# EAGLE design Schematic (EAGLE 9.6.2)
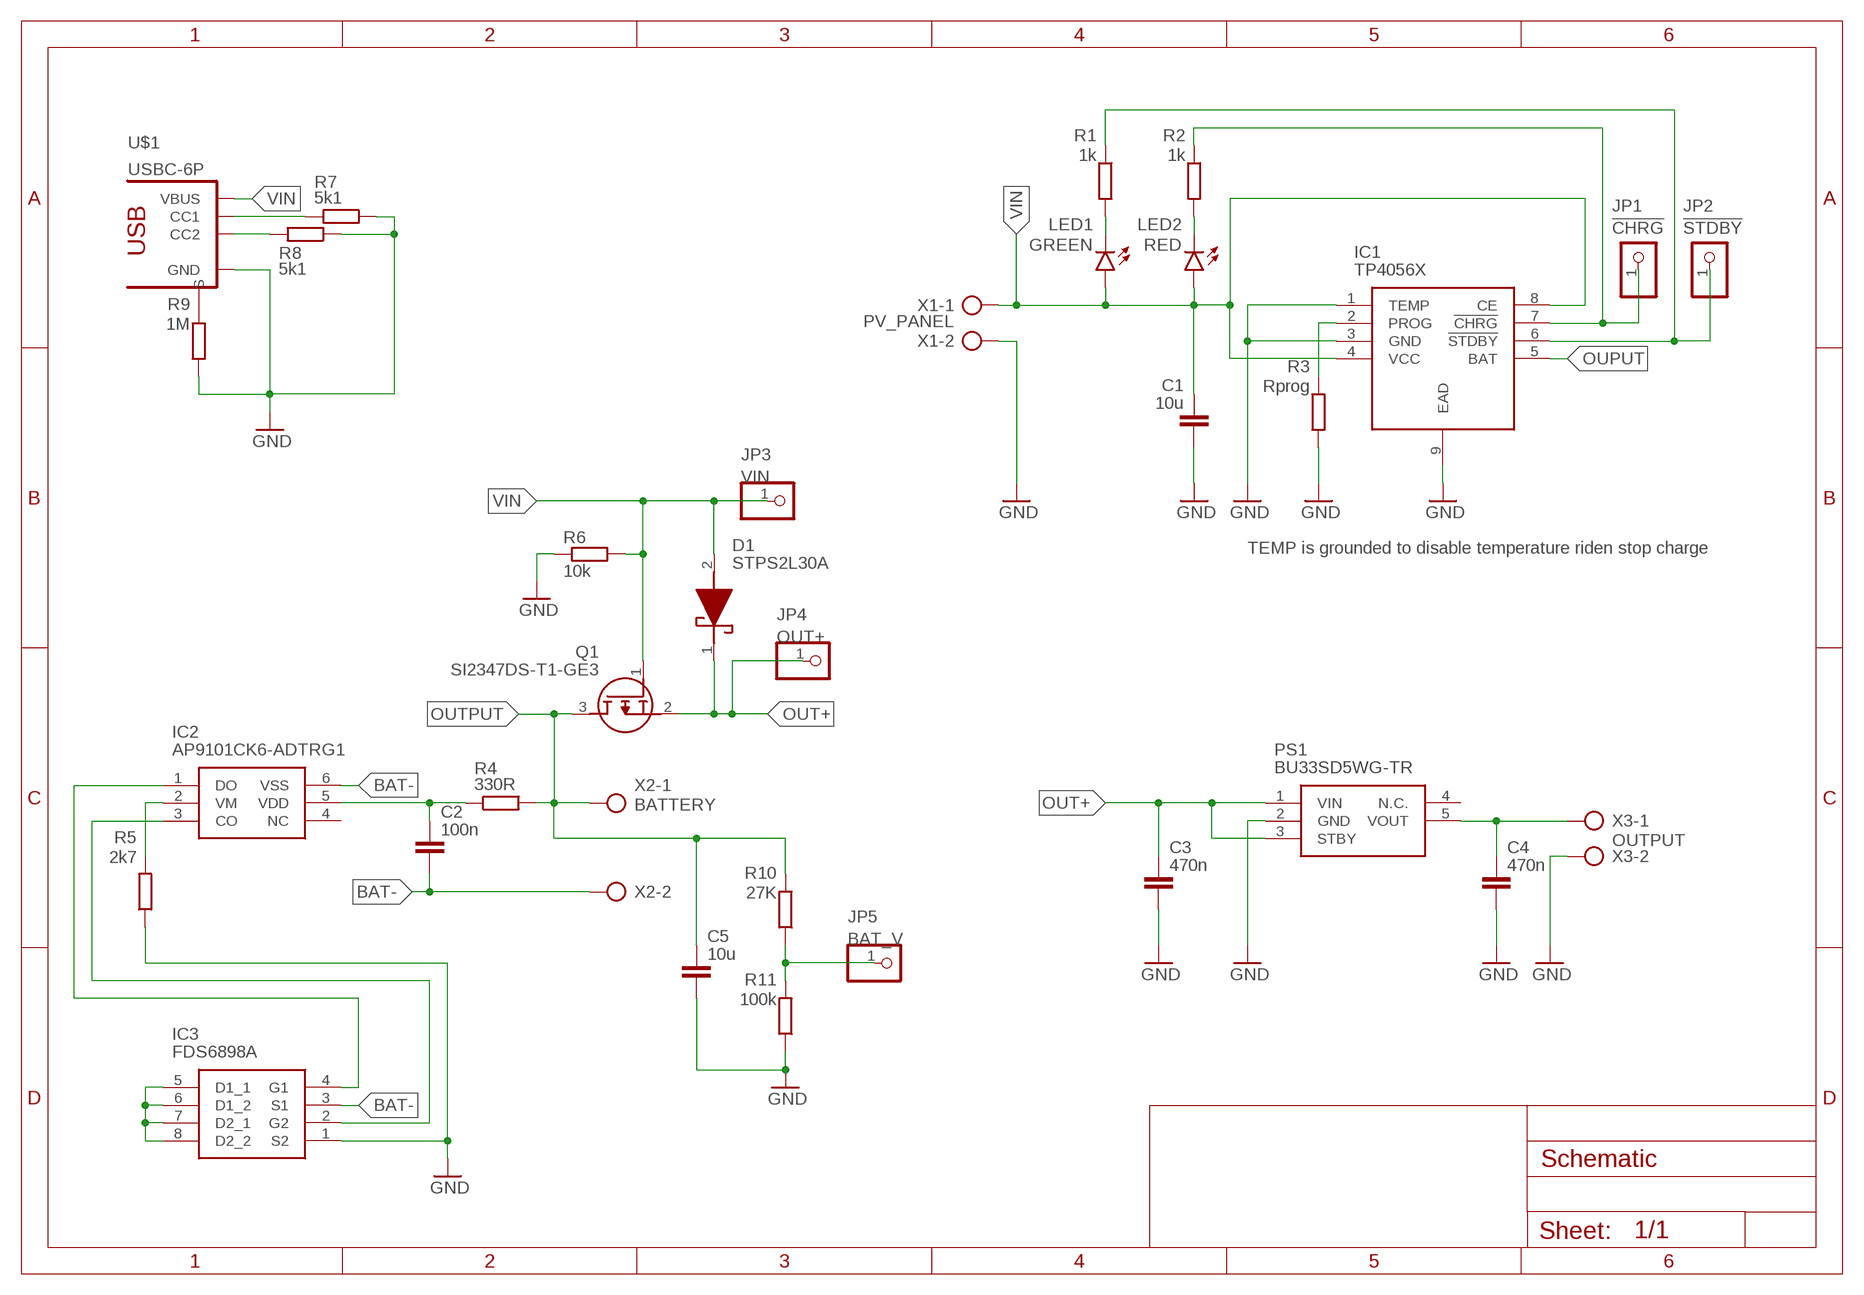
[diagram p0: schematic, sheet 1]

## Parts
C1  10u  C-EUC0805  [C0805]
C2  100n  C-EUC0805  [C0805]
C3  470n  C-EUC0805  [C0805]
C4  470n  C-EUC0805  [C0805]
C5  10u  C-EUC0805  [C0805]
D1  STPS2L30A  [DIOM5126X265N]
IC1  TP4056X  [SOIC127P600X175-9N]
IC2  AP9101CK6-ADTRG1  [SOT95P285X140-6N]
IC3  FDS6898A  [SOIC127P600X175-8N]
JP1  !CHRG  PINHD-1X1  [1X01]
JP2  !STDBY  PINHD-1X1  [1X01]
JP3  VIN  PINHD-1X1  [1X01]
JP4  OUT+  PINHD-1X1  [1X01]
JP5  BAT_V  PINHD-1X1  [1X01]
LED1  GREEN  LEDCHIPLED_0805  [CHIPLED_0805]
LED2  RED  LEDCHIPLED_0805  [CHIPLED_0805]
PS1  BU33SD5WG-TR  [SOT95P280X125-5N]
Q1  SI2347DS-T1-GE3  [SOT95P237X112-3N]
R1  1k  R-EU_R0805  [R0805]
R2  1k  R-EU_R0805  [R0805]
R3  Rprog  R-EU_R0805  [R0805]
R4  330R  R-EU_R0805  [R0805]
R5  2k7  R-EU_R0805  [R0805]
R6  10k  R-EU_R0805  [R0805]
R7  5k1  R-EU_R0805  [R0805]
R8  5k1  R-EU_R0805  [R0805]
R9  1M  R-EU_R0805  [R0805]
R10  27K  R-EU_R0805  [R0805]
R11  100k  R-EU_R0805  [R0805]
U$1  USBC-6P  [USCX-06FX-XXMX-01]
X1  PV_PANEL  AK300/2  [AK300/2]
X2  BATTERY  AK300/2  [AK300/2]
X3  OUTPUT  AK300/2  [AK300/2]

## Nets
BAT-: C2.2 IC2.6(VSS) IC3.3(S1) X2.2
GND: C1.2 C3.2 C4.2 C5.2 IC1.1(TEMP) IC1.3(GND) IC1.9(EAD) IC3.1(S2) PS1.2(GND) R3.2 R5.1 R6.1 R7.1 R8.1 R9.2 R11.1 U$1.GND1(GND) U$1.GND2(GND) X1.2 X3.2
N$1: LED1.C R1.2
N$2: LED2.C R2.2
N$3: IC1.6(!STDBY) JP2.1 R1.1
N$4: IC1.2(PROG) R3.1
N$5: C2.1 IC2.5(VDD) R4.1
N$6: IC1.7(!CHRG) JP1.1 R2.1
N$7: R9.1 U$1.SHIELD1(S) U$1.SHIELD2(S) U$1.SHIELD3(S) U$1.SHIELD4(S)
N$8: R8.2 U$1.CC2
N$9: IC2.2(VM) R5.2
N$10: IC2.1(DO) IC3.4(G1)
N$11: R7.2 U$1.CC1
N$12: IC2.3(CO) IC3.2(G2)
N$13: IC3.5(D1_1) IC3.6(D1_2) IC3.7(D2_1) IC3.8(D2_2)
N$14: C4.1 PS1.5(VOUT) X3.1
N$15: JP5.1 R10.1 R11.2
OUPUT: IC1.5(BAT)
OUT+: C3.1 D1.1(K) JP4.1 PS1.1(VIN) PS1.3(STBY) Q1.2(S)
OUTPUT: C5.1 Q1.3(D) R4.2 R10.2 X2.1
VIN: C1.1 D1.2(A) IC1.4(VCC) IC1.8(CE) JP3.1 LED1.A LED2.A Q1.1(G) R6.2 U$1.VBUS1(VBUS) U$1.VBUS2(VBUS) X1.1
Unconnected: IC2.4(NC) PS1.4(N.C.)

## Notes on the sheet
- TEMP is grounded to disable temperature riden stop charge

## Library data of the parts
C1-C5 = rcl:C-EU: CAPACITOR, European symbol; SPICEPREFIX: C
D1 = 1-component-search:STPS2L30A: STPS2L30A, Schottky Diode, 2A max, 30V, 2-Pin, SMA Source: Datasheet <http://www.st.com/web/en/resource/technical/document/datasheet/CD00001633.pdf>; ARROW_PART_NUMBER: STPS2L30A; ARROW_PRICE-STOCK: https://www.arrow.com/en/products/stps2l30a/stmicroelectronics?region=nac; DESCRIPTION: STPS2L30A, Schottky Diode, 2A max, 30V, 2-Pin, SMA; HEIGHT: 2.65mm; MANUFACTURER_NAME: STMicroelectronics; MANUFACTURER_PART_NUMBER: STPS2L30A; MOUSER_PART_NUMBER: 511-STPS2L30A; MOUSER_PRICE-STOCK: https://www.mouser.co.uk/ProductDetail/STMicroelectronics/STPS2L30A?qs=yAkVQ3mwCG0OEYUK4%252B3dww%3D%3D
IC1 = TP4056X:TP4056X: PMIC - Battery Management SOP-8_EP_150mil RoHS Source: Datasheet <https://datasheet.lcsc.com/szlcsc/Nanjing-Extension-Microelectronics-TP4056X_C191323.pdf>; DESCRIPTION: PMIC - Battery Management SOP-8_EP_150mil RoHS; HEIGHT: 1.75mm; MANUFACTURER_NAME: Nanjing Extension Microelectronics; MANUFACTURER_PART_NUMBER: TP4056X
IC2 = 1-component-search:AP9101CK6-ADTRG1: Battery Management Protect w/ Pwr Down 1-Cell LI 3.0uA 3.5V Source: Datasheet <https://www.diodes.com/assets/Datasheets/AP9101C.pdf>; ARROW_PART_NUMBER: AP9101CK6-ADTRG1; ARROW_PRICE-STOCK: https://www.arrow.com/en/products/ap9101ck6-adtrg1/diodes-incorporated?region=nac; DESCRIPTION: Battery Management Protect w/ Pwr Down 1-Cell LI 3.0uA 3.5V; HEIGHT: 1.4mm; MANUFACTURER_NAME: Diodes Inc.; MANUFACTURER_PART_NUMBER: AP9101CK6-ADTRG1; MOUSER_PART_NUMBER: 621-AP9101CK6-ADTRG1; MOUSER_PRICE-STOCK: https://www.mouser.co.uk/ProductDetail/Diodes-Incorporated/AP9101CK6-ADTRG1?qs=W66WzN12R3ZRpT78WZD49g%3D%3D
IC3 = 1-component-search:FDS6898A: ON SEMICONDUCTOR - FDS6898A. - MOSFET, DUAL, N, SMD, SO-8 Source: Datasheet <https://www.onsemi.com/pub/Collateral/FDS6898A-D.PDF>; ARROW_PART_NUMBER: FDS6898A; ARROW_PRICE-STOCK: https://www.arrow.com/en/products/fds6898a/on-semiconductor?region=nac; DESCRIPTION: ON SEMICONDUCTOR - FDS6898A. - MOSFET, DUAL, N, SMD, SO-8; HEIGHT: 1.75mm; MANUFACTURER_NAME: onsemi; MANUFACTURER_PART_NUMBER: FDS6898A; MOUSER_PART_NUMBER: 512-FDS6898A; MOUSER_PRICE-STOCK: https://www.mouser.co.uk/ProductDetail/ON-Semiconductor-Fairchild/FDS6898A?qs=rFoKx6q3%2F911Dc6GES2NNA%3D%3D
JP1 JP2 JP4 JP5 = pinhead:PINHD-1X1: PIN HEADER
JP3 = pinhead:PINHD-1X1: PIN HEADER; SPICEPREFIX: X
LED1 LED2 = led:LED: LED OSRAM: - CHIPLED LG R971, LG N971, LY N971, LG Q971, LY Q971, LO R971, LY R971 LH N974, LH R974 LS Q976, LO Q976, LY Q976 LO Q996 - Hyper CHIPLED LW Q18S LB Q993, LB Q99A, LB R99A - SideLED LS A670, LO A670, LY A670, LG A670, LP A670 LB A673, LV A673, LT A673, LW A673 LH A674 LY A675 LS A676, LA A676, LO A676, LY A676, LW A676 LS A679, LY A679, LG A679 - Hyper Micro SIDELED® LS Y876, LA Y876, LO Y876, LY Y876 LT Y87S - SmartLED LW L88C, LW L88S LB L89C, LB L89S, LG L890 LS L89K, LO L89K, LY L89K LS L896, LA L896, LO L896, LY L896 - TOPLED LS T670, LO T670, LY T670, LG T670, LP T670 LSG T670, LSP T670, LSY T670, LOP T670, LYG T670 LG T671, LOG T671, LSG T671 LB T673, LV T673, LT T673, LW T673 LH T674 LS T676, LA T676, LO T676, LY T676, LB T676, LH T676, LSB T676, LW T676 LB T67C, LV T67C, LT T67C, LS T67K, LO T67K, LY T67K, LW E67C LS E67B, LA E67B, LO E67B, LY E67B, LB E67C, LV E67C, LT E67C LW T67C LS T679, LY T679, LG T679 LS T770, LO T770, LY T770, LG T770, LP T770 LB T773, LV T773, LT T773, LW T773 LH T774 LS E675, LA E675, LY E675, LS T675 LS T776, LA T776, LO T776, LY T776, LB T776 LHGB T686 LT T68C, LB T68C - Hyper Mini TOPLED® LB M676 - Mini TOPLED Santana® LG M470 LS M47K, LO M47K, LY M47K Source: http://www.osram.convergy.de LUXEON: - LUMILED® LXK2-PW12-R00, LXK2-PW12-S00, LXK2-PW14-U00, LXK2-PW14-V00 LXK2-PM12-R00, LXK2-PM12-S00, LXK2-PM14-U00 LXK2-PE12-Q00, LXK2-PE12-R00, LXK2-PE12-S00, LXK2-PE14-T00, LXK2-PE14-U00 LXK2-PB12-K00, LXK2-PB12-L00, LXK2-PB12-M00, LXK2-PB14-N00, LXK2-PB14-P00, LXK2-PB14-Q00 LXK2-PR12-L00, LXK2-PR12-M00, LXK2-PR14-Q00, LXK2-PR14-R00 LXK2-PD12-Q00, LXK2-PD12-R00, LXK2-PD12-S00 LXK2-PH12-R00, LXK2-PH12-S00 LXK2-PL12-P00, LXK2-PL12-Q00, LXK2-PL12-R00 Source: www.luxeon.com KINGBRIGHT: KA-3528ASYC Source: www.kingbright.com
PS1 = 1-component-search:BU33SD5WG-TR: LDO regulator,3.3V,0.5A,standby,SSOP5 ROHM BU33SD5WG-TR, LDO Voltage Regulator, 0.5A, 3.3 V +/-2%, 1.7 6 Vin, 5-Pin SSOP Source: Datasheet <https://componentsearchengine.com/Datasheets/1/BU33SD5WG-TR.pdf>; DESCRIPTION: LDO regulator,3.3V,0.5A,standby,SSOP5 ROHM BU33SD5WG-TR, LDO Voltage Regulator, 0.5A, 3.3 V +/-2%, 1.7 6 Vin, 5-Pin SSOP; HEIGHT: 1.25mm; MANUFACTURER_NAME: ROHM Semiconductor; MANUFACTURER_PART_NUMBER: BU33SD5WG-TR; MOUSER_PART_NUMBER: 755-BU33SD5WG-TR; MOUSER_PRICE-STOCK: https://www.mouser.co.uk/ProductDetail/ROHM-Semiconductor/BU33SD5WG-TR?qs=%2FKR40Cd6GUrQDzRkUEt69Q%3D%3D
Q1 = 1-component-search:SI2347DS-T1-GE3: P-Ch MOSFET SOT-23 copper 30V 42mohm @ 1 Source: Datasheet <https://www.vishay.com/docs/62827/si2347ds.pdf>; ARROW_PART_NUMBER: SI2347DS-T1-GE3; ARROW_PRICE-STOCK: https://www.arrow.com/en/products/si2347ds-t1-ge3/vishay?region=nac; DESCRIPTION: P-Ch MOSFET SOT-23 copper 30V 42mohm @ 1; HEIGHT: 1.12mm; MANUFACTURER_NAME: Vishay; MANUFACTURER_PART_NUMBER: Si2347DS-T1-GE3; MOUSER_PART_NUMBER: 78-SI2347DS-T1-GE3; MOUSER_PRICE-STOCK: https://www.mouser.co.uk/ProductDetail/Vishay-Semiconductors/SI2347DS-T1-GE3?qs=wnm%2FPMJNddFQv4lfacOrcA%3D%3D
R1-R11 = rcl:R-EU_: RESISTOR, European symbol; SPICEPREFIX: R
U$1 = USBC6P:USBC-6P: AliExpress Special! Connect 5.1k 10% resistors to each CC pin, pulled up to 3.3v or 5.0v.
X1-X3 = con-ptr500:AK300/2: CONNECTOR; OC_FARNELL: unknown; OC_NEWARK: unknown

## Board
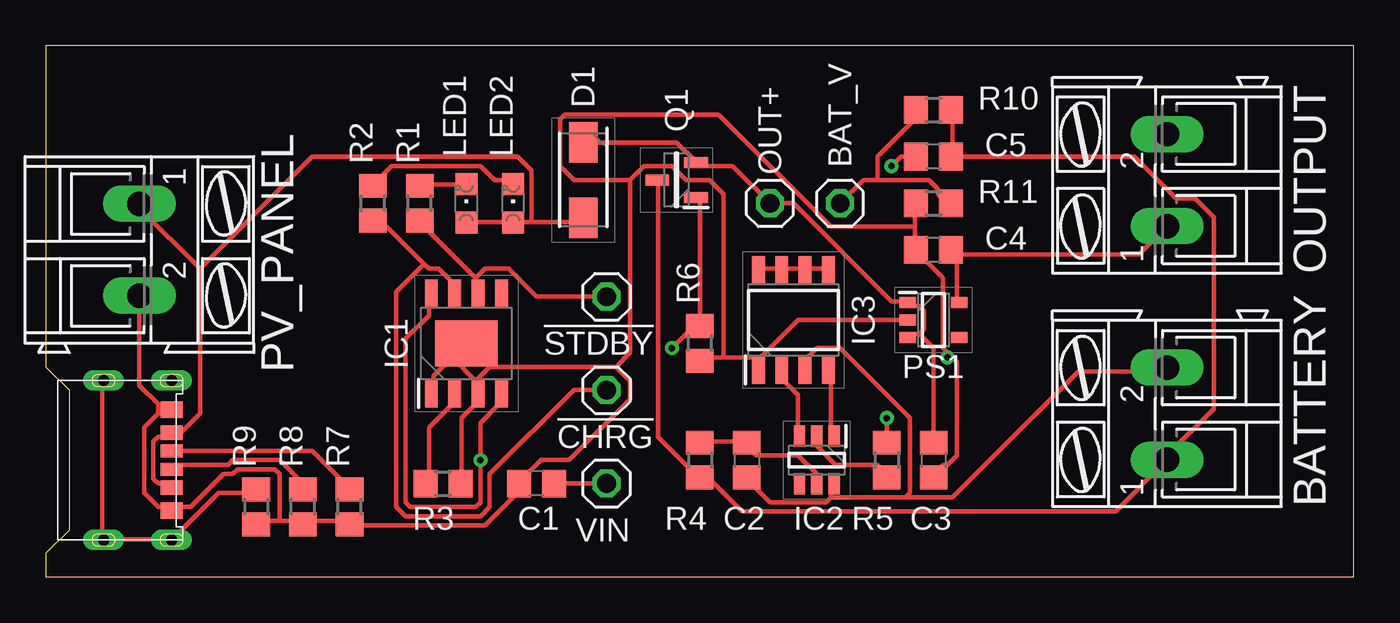
[diagram p1: board, top side]
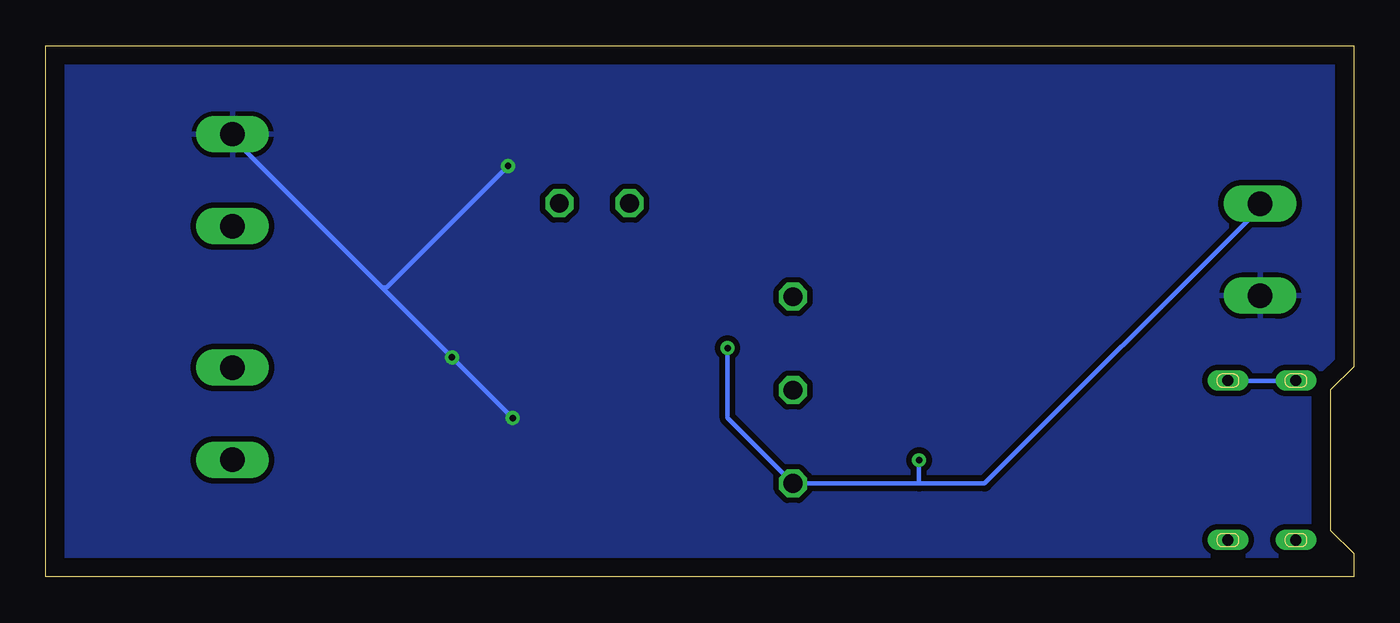
[diagram p2: board, bottom side, seen from below]

Size 71.1 x 28.88 mm. Coordinates in mm from the lower left corner, seen from the top.
Outline: 0,0 71.1,0 71.1,28.88 0,28.88 0,11.43 1.27,10.16 1.27,2.54 0,1.27 0,0
Copper layers (1*16): Top 0.035mm / dielectric 1.5mm / Bottom 0.035mm
Design rules "default *": minimum track width 10mil, minimum drill 0.35mm, track to track 10mil, track to pad 10mil, pad to pad 10mil, via to via 10mil, smd to smd 10mil, copper to edge 40mil, drill to drill 6mil, minimum pad ring 10mil, minimum via ring 8mil, stop-mask expansion 4mil, vias tented up to drill 0mil, thermal gap 10mil

### Footprints (pad centres in the part's own frame; a part is rotated, then mirrored left to right if it is on the bottom)
C0805 = smd 1.3 x 1.5: 1 -0.95,0; 2 0.95,0
DIOM5126X265N = smd 2.2 x 1.55: 1 -2.05,0; 2 2.05,0
SOIC127P600X175-9N = smd 1.525 x 0.7: 1 -2.712,1.905; 2 -2.712,0.635; 3 -2.712,-0.635; 4 -2.712,-1.905; 5 2.712,-1.905; 6 2.712,-0.635; 7 2.712,0.635; 8 2.712,1.905 | smd 2.513 x 3.402: 9 0,0
SOT95P285X140-6N = smd 1.15 x 0.6: 1 -1.3,0.95; 2 -1.3,0; 3 -1.3,-0.95; 4 1.3,-0.95; 5 1.3,0; 6 1.3,0.95
SOIC127P600X175-8N = smd 1.525 x 0.7: 1 -2.712,1.905; 2 -2.712,0.635; 3 -2.712,-0.635; 4 -2.712,-1.905; 5 2.712,-1.905; 6 2.712,-0.635; 7 2.712,0.635; 8 2.712,1.905
1X01 = drill 1.016 octagon: 1 0,0
CHIPLED_0805 = smd 1.2 x 1.2: A 0,-1.05; C 0,1.05
SOT95P280X125-5N = smd 0.9 x 0.6: 1 -1.4,0.95; 2 -1.4,0; 3 -1.4,-0.95; 4 1.4,-0.95; 5 1.4,0.95
SOT95P237X112-3N = smd 1.3 x 0.6: 1 -1.05,0.95; 2 -1.05,-0.95; 3 1.05,0
R0805 = smd 1.3 x 1.5: 1 -0.95,0; 2 0.95,0
USCX-06FX-XXMX-01 = smd 0.7 x 1.2: CC1 0.5,-1.75; CC2 -0.5,-1.75 | smd 0.9 x 1.2: GND1 2.75,-1.75; GND2 -2.75,-1.75 | drill 0.6 long: SHIELD1 4.325,1.95; SHIELD2 4.325,-1.75; SHIELD3 -4.35,-1.75; SHIELD4 -4.35,1.95 | smd 0.8 x 1.2: VBUS1 1.5,-1.75; VBUS2 -1.5,-1.75
AK300/2 = drill 1.321 long: 1 -2.515,0; 2 2.489,0

### Placement (x,y rotation side)
C1  26.67,5.08 180 top
C2  38.1,6.35 270 top
C3  48.26,6.35 270 top
C4  48.26,17.78 180 top
C5  48.26,22.86 180 top
D1  29.21,21.59 270 top
IC1  22.86,12.7 90 top
IC2  41.91,6.35 270 top
IC3  40.64,13.97 90 top
JP1  30.48,10.16 90 top
JP2  30.48,15.24 90 top
JP3  30.48,5.08 90 top
JP4  39.37,20.32 180 top
JP5  43.18,20.32 180 top
LED1  22.86,20.32 0 top
LED2  25.4,20.32 0 top
PS1  48.26,13.97 0 top
Q1  34.29,21.59 180 top
R1  20.32,20.32 90 top
R2  17.78,20.32 90 top
R3  21.59,5.08 0 top
R4  35.56,6.35 270 top
R5  45.72,6.35 270 top
R6  35.56,12.7 90 top
R7  16.51,3.81 90 top
R8  13.97,3.81 90 top
R9  11.43,3.81 270 top
R10  48.26,25.4 0 top
R11  48.26,20.32 0 top
U$1  5.08,6.35 90 top
X1  5.08,17.78 270 top
X2  60.96,8.89 90 top
X3  60.96,21.59 90 top

### Tracks (layer width: path | path; a pad name or v marks a point on that pad's centre or on a via)
BAT-
  Top 0.254: 42.67,4.32 42.67,4.83 IC2.6 | 42.67,4.32 42.42,4.06 39.37,4.06 38.1,5.33 C2.2 | 46.74,4.32 46.99,4.57 46.99,8.64 43.18,12.45 41.91,12.45 41.4,11.94 41.4,11.43 IC3.3 | 42.67,4.32 46.74,4.32 | 46.74,4.32 49.28,4.32 56.13,11.18 60.96,11.18 X2.2
GND  (via drill 0.35)
  Top 0.254: 47.24,19.05 47.24,20.32 R11.1 | 47.24,19.05 47.24,17.78 | 49.02,12.19 48.77,12.45 48.77,16.26 47.24,17.78 | 49.02,12.19 49.53,11.68 49.53,6.6 49.02,6.1 48.77,6.1 48.26,5.59 C3.2 | 47.24,17.78 C4.2 | v45.72,8.64 R5.1 | C5.2 46.48,22.86 v45.97,22.35 | v49.02,11.94 49.02,12.19 | 6.1,8.89 5.33,8.13 5.33,4.57 6.1,3.81 6.6,3.81 U$1.GND2 6.86,3.81 7.87,3.81 9.65,5.59 10.16,5.59 10.41,5.84 12.45,5.84 12.7,5.59 12.7,3.05 | 6.1,8.89 6.6,8.89 U$1.GND1 | 6.1,8.89 6.1,9.4 5.08,10.41 X1.2 | PS1.2 40.89,13.97 38.86,11.94 | 38.86,11.94 38.86,11.43 IC3.1 38.86,11.94 | 38.86,11.94 36.83,11.94 | 36.83,11.94 35.56,11.94 R6.1 | R3.2 22.61,5.08 22.61,8.64 23.37,9.4 23.37,9.91 IC1.3 | 22.1,11.94 21.08,10.92 21.08,10.16 IC1.1 | 23.37,10.67 23.37,10.16 IC1.3 | 22.1,11.94 23.37,10.67 | 22.1,11.94 IC1.9 | 13.97,3.05 12.7,3.05 | 12.7,3.05 11.43,3.05 R9.2 | 13.97,3.05 16.51,3.05 R7.1 16.51,2.79 23.88,2.79 25.65,4.57 25.65,5.08 | 13.97,3.05 R8.1 | 23.37,10.67 24.13,11.43 30.99,11.43 | 30.99,11.43 31.75,10.67 31.75,9.65 28.45,6.35 26.92,6.35 25.65,5.08 | 23.37,10.67 IC1.3 | 25.65,5.08 C1.2 | 36.83,11.94 36.83,20.83 36.07,21.59 34.8,21.59 34.04,22.35 32.51,22.35 31.75,21.59 | 31.75,21.59 31.75,12.19 30.99,11.43 | 47.24,19.05 42.67,19.05 36.58,25.15 28.19,25.15 27.94,24.89 27.94,22.35 28.7,21.59 31.75,21.59
  Bottom 0.254: 52.83,15.75 60.96,23.88 X3.2 | 52.83,15.75 v49.02,11.94 v45.72,8.64 | v45.97,22.35 52.58,15.75 52.83,15.75
  pour Bottom (isolate 0.305): 0,0 0,1.27 1.27,2.54 1.27,10.16 0,11.43 0,29.21 71.12,29.21 71.12,0
N$1
  Top 0.254: LED1.C 22.86,21.34 20.32,21.34 R1.2
N$2
  Top 0.254: LED2.C 25.4,21.59 24.38,21.59 23.62,22.35 18.8,22.35 17.78,21.34 R2.2
N$3
  Top 0.254: 23.37,16.26 20.32,19.3 R1.1 | 23.37,16.26 23.37,15.49 IC1.6 | JP2.1 26.67,15.24 25.15,16.76 23.88,16.76 23.37,16.26
N$4
  Top 0.254: R3.1 20.83,5.08 20.83,8.13 22.1,9.4 22.1,9.91 IC1.2
N$5
  Top 0.254: IC2.5 41.91,5.59 40.89,6.6 38.61,6.6 38.1,7.11 C2.1 38.1,7.37 35.56,7.37 R4.1
N$6
  Top 0.254: 20.57,17.02 20.83,16.76 21.34,16.76 22.1,16 22.1,15.49 IC1.7 | 20.57,17.02 18.29,19.3 17.78,19.3 R2.1 | JP1.1 28.7,10.16 24.13,5.59 24.13,3.81 23.62,3.3 19.56,3.3 19.05,3.81 19.05,15.49 20.57,17.02
N$7
  Top 0.254: R9.1 11.43,4.57 9.4,4.57 6.86,2.03 U$1.SHIELD3 6.6,2.03 3.3,2.03 U$1.SHIELD4 3.05,2.03 3.05,10.67 U$1.SHIELD1
  Bottom 0.254: U$1.SHIELD1 3.3,10.67 6.6,10.67 U$1.SHIELD2
N$8
  Top 0.254: R8.2 13.97,5.08 12.7,6.35 10.16,6.35 9.91,6.1 6.86,6.1 U$1.CC2
N$9
  Top 0.254: IC2.2 41.91,7.11 42.93,6.1 45.21,6.1 45.72,5.59 R5.2
N$10
  Top 0.254: IC2.1 42.67,7.87 42.67,11.18 IC3.4
N$11
  Top 0.254: U$1.CC1 6.86,6.86 14.48,6.86 16.51,4.83 R7.2
N$12
  Top 0.254: IC2.3 40.89,7.87 40.89,9.91 40.13,10.67 40.13,11.18 IC3.2
N$13
  Top 0.254: IC3.8 38.86,16.76 39.88,16.76 IC3.7 40.13,16.76 41.15,16.76 IC3.6 41.4,16.76 42.42,16.76 IC3.5
N$14
  Top 0.254: 49.53,17.53 49.53,14.99 PS1.5 | 49.53,17.53 49.28,17.78 C4.1 49.53,17.53 | 49.53,17.53 59.44,17.53 60.96,19.05 X3.1
N$15
  Top 0.254: 45.21,21.59 44.45,21.59 JP5.1 | 45.21,21.59 48.01,21.59 48.51,21.08 48.51,20.83 49.02,20.32 R11.2 | 45.21,21.59 45.21,22.86 47.24,24.89 47.24,25.4 R10.1
OUT+
  Top 0.254: 47.5,13.21 46.99,13.21 PS1.3 | 47.5,13.21 47.75,13.46 47.75,14.48 47.5,14.73 46.99,14.73 PS1.1 46.74,14.99 45.97,14.99 40.64,20.32 JP4.1 37.34,22.35 35.56,22.35 Q1.2 35.31,22.61 34.29,23.62 29.21,23.62 D1.1 | C3.1 48.26,12.45 47.5,13.21
OUTPUT
  Top 0.254: 35.56,5.33 33.27,7.62 33.27,21.59 Q1.3 | 49.28,22.86 49.28,25.4 R10.2 | 49.28,22.86 59.18,22.86 61.47,20.57 62.48,20.57 63.5,19.56 63.5,9.14 60.96,6.6 X2.1 60.96,6.35 58.17,3.56 37.85,3.56 36.07,5.33 35.56,5.33 | 49.28,22.86 C5.1 | 35.56,5.33 R4.2
VIN  (via drill 0.35)
  Top 0.254: IC1.8 20.83,15.24 20.83,14.22 19.56,12.95 19.56,4.06 19.81,3.81 23.37,3.81 23.62,4.06 v23.62,6.35 23.62,8.38 24.64,9.4 24.64,9.91 IC1.4 | 25.4,19.3 22.86,19.3 LED1.A | 26.42,19.3 29.21,19.3 D1.2 | 26.42,19.3 25.4,19.3 | 25.4,19.3 LED2.A | Q1.1 35.56,20.57 R6.2 35.56,13.46 35.05,13.46 v34.04,12.45 | JP3.1 C1.1 | U$1.VBUS2 6.6,5.08 6.1,5.08 5.84,5.33 5.84,7.37 6.1,7.62 6.6,7.62 U$1.VBUS1 6.86,7.87 7.37,7.87 8.38,8.89 8.38,16.76 | 8.38,16.76 5.08,20.07 X1.1 | 26.42,19.3 26.42,22.1 25.65,22.86 14.48,22.86 8.38,16.76
  Bottom 0.254: 23.62,5.08 20.07,5.08 5.08,20.07 X1.1 | 23.62,5.08 JP3.1 34.04,8.64 v34.04,12.45 | 23.62,5.08 v23.62,6.35